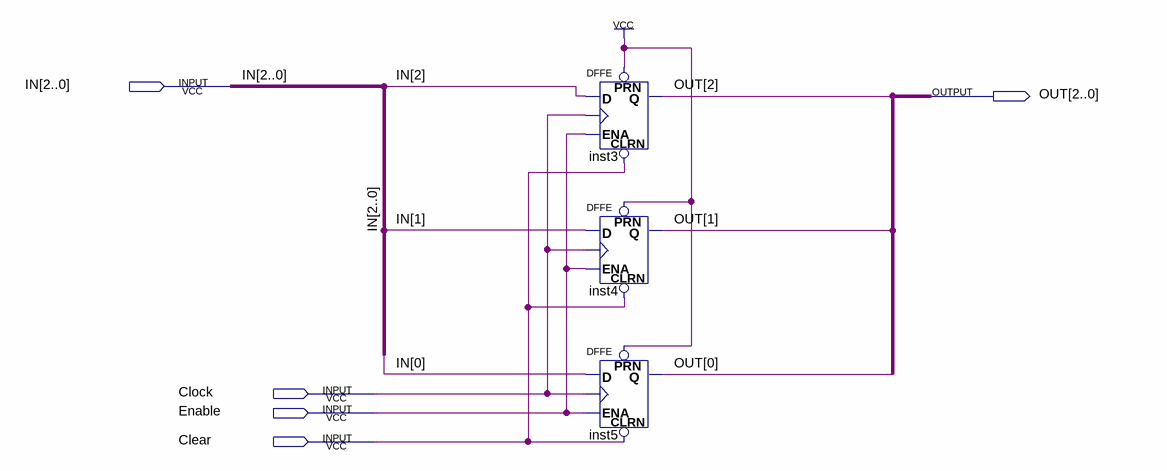
[diagram p0: schematic sheet]
// Quartus schematic OP.bdf as structural Verilog: 3 symbols, 5 pins
module OP (
  input  [2:0] IN,
  input  Clock,
  input  Enable,
  input  Clear,
  output [2:0] OUT
);

  DFFE inst3 (.PRN(1'b1), .CLRN(Clear), .D(IN[2]), .CLK(Clock), .ENA(Enable), .Q(OUT[2]));
  DFFE inst4 (.PRN(1'b1), .CLRN(Clear), .D(IN[1]), .CLK(Clock), .ENA(Enable), .Q(OUT[1]));
  DFFE inst5 (.PRN(1'b1), .CLRN(Clear), .D(IN[0]), .CLK(Clock), .ENA(Enable), .Q(OUT[0]));
endmodule
